# EAGLE design dueSkelMADE (EAGLE 8.2.2)
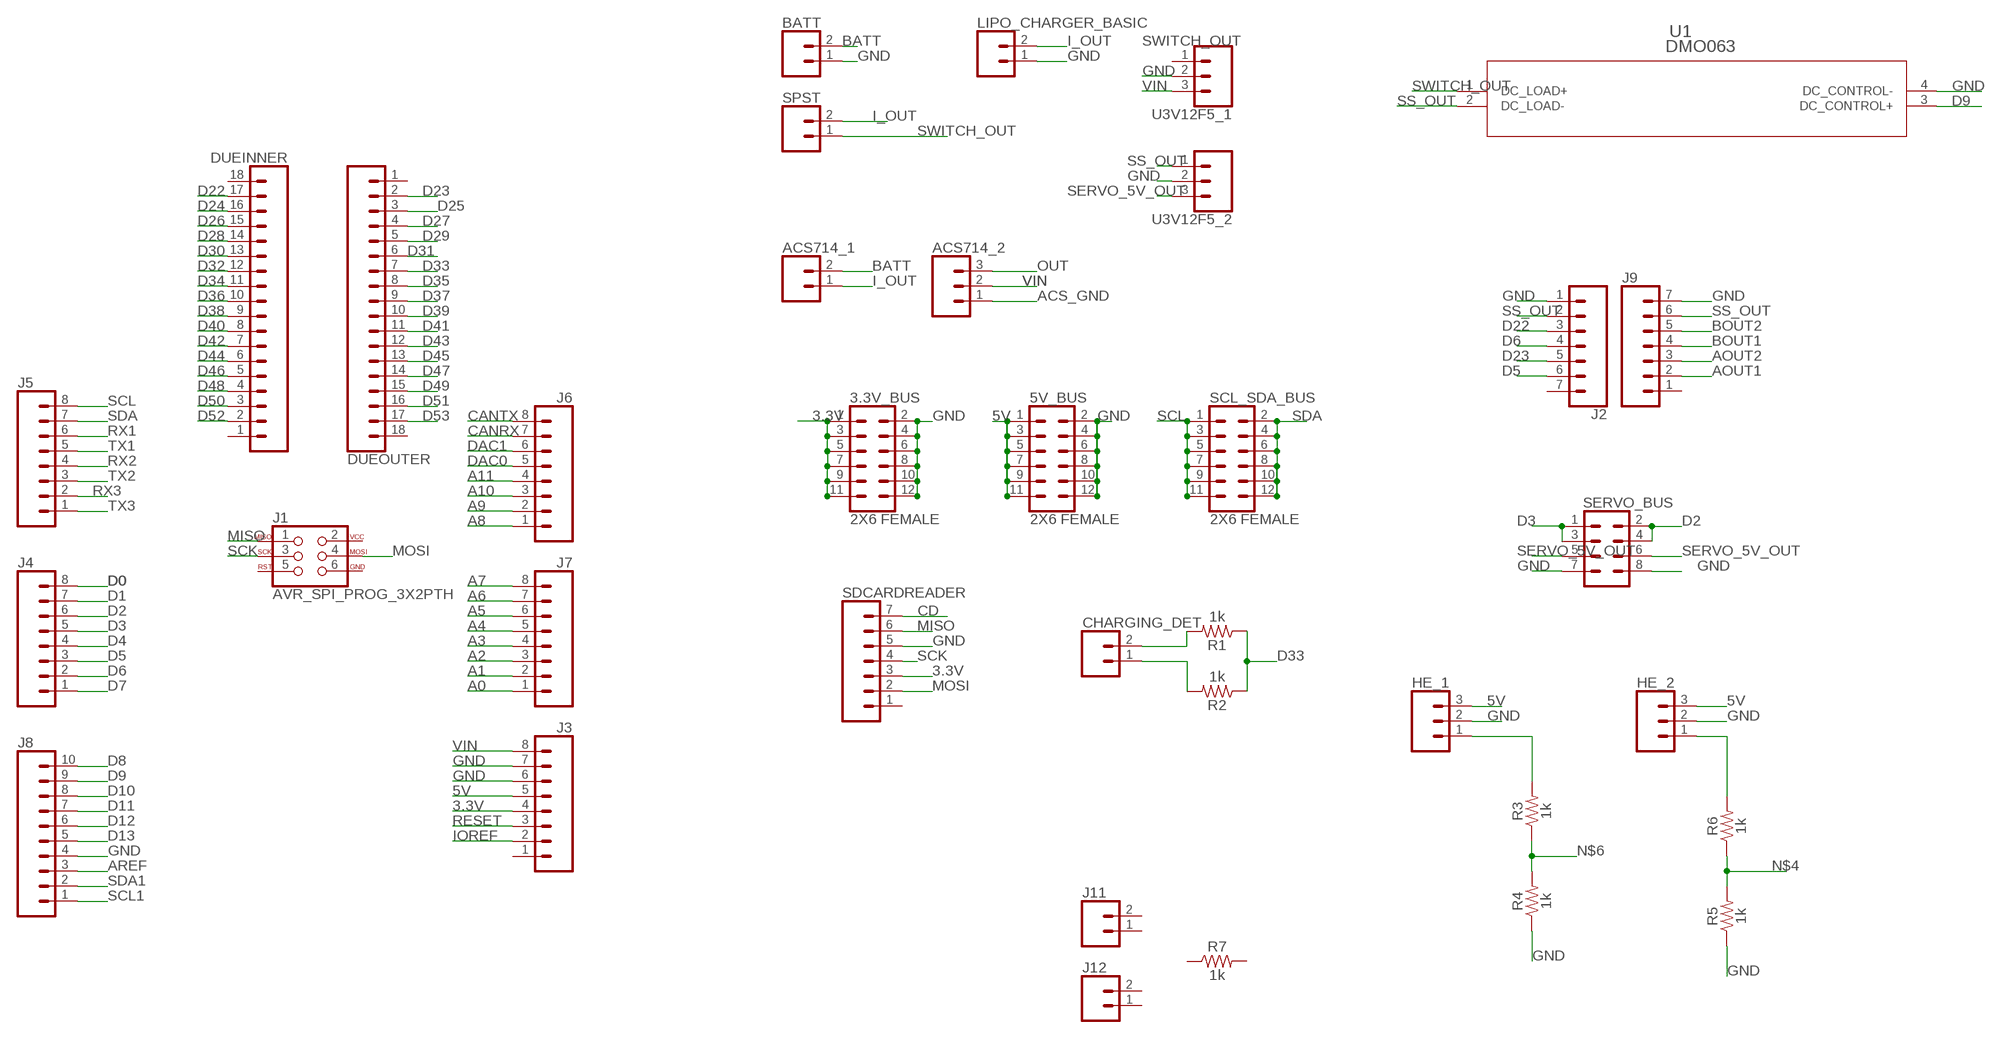
[diagram p0: schematic, sheet 1]

## Parts
3.3V_BUS  2X6 FEMALE  CONN_06X2PTH_FEMALE  [2X6]
5V_BUS  2X6 FEMALE  CONN_06X2PTH_FEMALE  [2X6]
ACS714_1  CONN_02  [1X02]
ACS714_2  CONN_03  [1X03]
BATT  CONN_02  [1X02]
CHARGING_DET  CONN_02  [1X02]
DUEINNER  CONN_18  [1X18]
DUEOUTER  CONN_18  [1X18]
HE_1  CONN_03  [1X03]
HE_2  CONN_03  [1X03]
J1  AVR_SPI_PROG_3X2PTH  [2X3]
J2  CONN_07  [1X07]
J3  CONN_08"  [1X08]
J4  CONN_08"  [1X08]
J5  CONN_08"  [1X08]
J6  CONN_08"  [1X08]
J7  CONN_08"  [1X08]
J8  CONN_10"  [1X10]
J9  CONN_07  [1X07]
J11  CONN_02  [1X02]
J12  CONN_02  [1X02]
LIPO_CHARGER_BASIC  CONN_02  [1X02]
R1  1k  1KOHM-HORIZ-1/4W-1%  [AXIAL-0.3]
R2  1k  1KOHM-HORIZ-1/4W-1%  [AXIAL-0.3]
R3  1k  1KOHM-HORIZ-1/4W-1%  [AXIAL-0.3]
R4  1k  1KOHM-HORIZ-1/4W-1%  [AXIAL-0.3]
R5  1k  1KOHM-HORIZ-1/4W-1%  [AXIAL-0.3]
R6  1k  1KOHM-HORIZ-1/4W-1%  [AXIAL-0.3]
R7  1k  1KOHM-HORIZ-1/4W-1%  [AXIAL-0.3]
SCL_SDA_BUS  2X6 FEMALE  CONN_06X2PTH_FEMALE  [2X6]
SDCARDREADER  CONN_07  [1X07]
SERVO_BUS  CONN_04X2  [2X4]
SPST  CONN_02  [1X02]
U1  DMO063  [SIP-4_DMO]
U3V12F5_1  CONN_03  [1X03]
U3V12F5_2  CONN_03  [1X03]

## Nets
3.3V: 3.3V_BUS.1 3.3V_BUS.3 3.3V_BUS.5 3.3V_BUS.7 3.3V_BUS.9 3.3V_BUS.11 J3.4 SDCARDREADER.3
5V: 5V_BUS.1 5V_BUS.3 5V_BUS.5 5V_BUS.7 5V_BUS.9 5V_BUS.11 HE_1.3 HE_2.3 J3.5
A0: J7.1
A1: J7.2
A2: J7.3
A3: J7.4
A4: J7.5
A5: J7.6
A6: J7.7
A7: J7.8
A8: J6.1
A9: J6.2
A10: J6.3
A11: J6.4
ACS_GND: ACS714_2.1
AOUT1: J9.2
AOUT2: J9.3
AREF: J8.3
BATT: ACS714_1.2 BATT.2
BOUT1: J9.4
BOUT2: J9.5
CANRX: J6.7
CANTX: J6.8
CD: SDCARDREADER.7
D0: J4.8
D1: J4.7
D2: J4.6 SERVO_BUS.2 SERVO_BUS.4
D3: J4.5 SERVO_BUS.1 SERVO_BUS.3
D4: J4.4
D5: J2.6 J4.3
D6: J2.4 J4.2
D7: J4.1
D8: J8.10
D9: J8.9 U1.3(DC_CONTROL+)
D10: J8.8
D11: J8.7
D12: J8.6
D13: J8.5
D22: DUEINNER.17 J2.3
D23: DUEOUTER.2 J2.5
D24: DUEINNER.16
D25: DUEOUTER.3
D26: DUEINNER.15
D27: DUEOUTER.4
D28: DUEINNER.14
D29: DUEOUTER.5
D30: DUEINNER.13
D31: DUEOUTER.6
D32: DUEINNER.12
D33: DUEOUTER.7 R1.P$1 R2.P$1
D34: DUEINNER.11
D35: DUEOUTER.8
D36: DUEINNER.10
D37: DUEOUTER.9
D38: DUEINNER.9
D39: DUEOUTER.10
D40: DUEINNER.8
D41: DUEOUTER.11
D42: DUEINNER.7
D43: DUEOUTER.12
D44: DUEINNER.6
D45: DUEOUTER.13
D46: DUEINNER.5
D47: DUEOUTER.14
D48: DUEINNER.4
D49: DUEOUTER.15
D50: DUEINNER.3
D51: DUEOUTER.16
D52: DUEINNER.2
D53: DUEOUTER.17
DAC0: J6.5
DAC1: J6.6
GND: 3.3V_BUS.2 3.3V_BUS.4 3.3V_BUS.6 3.3V_BUS.8 3.3V_BUS.10 3.3V_BUS.12 5V_BUS.2 5V_BUS.4 5V_BUS.6 5V_BUS.8 5V_BUS.10 5V_BUS.12 BATT.1 HE_1.2 HE_2.2 J2.1 J3.6 J3.7 J8.4 J9.7 LIPO_CHARGER_BASIC.1 R4.P$1 R5.P$1 SDCARDREADER.5 SERVO_BUS.7 SERVO_BUS.8 U1.4(DC_CONTROL-) U3V12F5_1.2 U3V12F5_2.2
I_OUT: ACS714_1.1 LIPO_CHARGER_BASIC.2 SPST.2
IOREF: J3.2
MISO: J1.1 SDCARDREADER.6
MOSI: J1.4 SDCARDREADER.2
N$1: CHARGING_DET.1 R2.P$2
N$2: CHARGING_DET.2 R1.P$2
N$3: HE_2.1 R6.P$2
N$4: R5.P$2 R6.P$1
N$5: HE_1.1 R3.P$2
N$6: R3.P$1 R4.P$2
OUT: ACS714_2.3
RESET: J3.3
RX1: J5.6
RX2: J5.4
RX3: J5.2
SCK: J1.3 SDCARDREADER.4
SCL: J5.8 SCL_SDA_BUS.1 SCL_SDA_BUS.3 SCL_SDA_BUS.5 SCL_SDA_BUS.7 SCL_SDA_BUS.9 SCL_SDA_BUS.11
SCL1: J8.1
SDA: J5.7 SCL_SDA_BUS.2 SCL_SDA_BUS.4 SCL_SDA_BUS.6 SCL_SDA_BUS.8 SCL_SDA_BUS.10 SCL_SDA_BUS.12
SDA1: J8.2
SERVO_5V_OUT: SERVO_BUS.5 SERVO_BUS.6 U3V12F5_2.3
SS_OUT: J2.2 J9.6 U1.2(DC_LOAD-) U3V12F5_2.1
SWITCH_OUT: SPST.1 U1.1(DC_LOAD+)
TX1: J5.5
TX2: J5.3
TX3: J5.1
VIN: ACS714_2.2 J3.8 U3V12F5_1.3
Unconnected: DUEINNER.1 DUEINNER.18 DUEOUTER.1 DUEOUTER.18 J1.2 J1.5 J1.6 J2.7 J3.1 J9.1 J11.1 J11.2 J12.1 J12.2 R7.P$1 R7.P$2 SDCARDREADER.1 U3V12F5_1.1

## Library data of the parts
3.3V_BUS 5V_BUS SCL_SDA_BUS = SparkFun-Connectors:CONN_06X2: Multi connection point. Often used as Generic Header-pin footprint for 0.1 inch spaced/style header connections On any of the 0.1 inch spaced packages, you can populate with these: Break Away Headers - Straight <https://www.sparkfun.com/products/116> (PRT-00116) Break Away Male Headers - Right Angle <https://www.sparkfun.com/products/553> (PRT-00553) Female Headers <https://www.sparkfun.com/products/115> (PRT-00115) Break Away Headers - Machine Pin <https://www.sparkfun.com/products/117> (PRT-00117) Break Away Female Headers - Swiss Machine Pin <https://www.sparkfun.com/products/743> (PRT-00743); PROD_ID: CONN-12423
ACS714_1 BATT CHARGING_DET J11 J12 LIPO_CHARGER_BASIC SPST = SparkFun-Connectors:CONN_02: Multi connection point. Often used as Generic Header-pin footprint for 0.1 inch spaced/style header connections On any of the 0.1 inch spaced packages, you can populate with these: Break Away Headers - Straight <https://www.sparkfun.com/products/116> (PRT-00116) Break Away Male Headers - Right Angle <https://www.sparkfun.com/products/553> (PRT-00553) Female Headers <https://www.sparkfun.com/products/115> (PRT-00115) Break Away Headers - Machine Pin <https://www.sparkfun.com/products/117> (PRT-00117) Break Away Female Headers - Swiss Machine Pin <https://www.sparkfun.com/products/743> (PRT-00743) For SCREWTERMINALS and SPRING TERMINALS visit here: Screw Terimnals on SparkFun.com <https://www.sparkfun.com/search/results?term=Screw+Terminals> (5mm/3.5mm/2.54mm spacing) This device is also useful as a general connection point to wire up your design to another part of your project. Our various solder wires solder well into these plated through hole pads. Hook-Up Wire - Assortment (Stranded, 22 AWG) <https://www.sparkfun.com/products/11375> (PRT-11375) Hook-Up Wire - Assortment (Solid Core, 22 AWG) <https://www.sparkfun.com/products/11367> (PRT-11367) View the entire wire category on our website here <https://www.sparkfun.com/categories/141> Special notes: Molex polarized connector foot print use with: PRT-08233 with associated crimp pins and housings. 2.54_SCREWTERM for use with PRT-10571. 3.5mm Screw Terminal footprints for PRT-08084 5mm Screw Terminal footprints for use with PRT-08432
ACS714_2 HE_1 HE_2 U3V12F5_1 U3V12F5_2 = SparkFun-Connectors:CONN_03: Multi connection point. Often used as Generic Header-pin footprint for 0.1 inch spaced/style header connections On any of the 0.1 inch spaced packages, you can populate with these: Break Away Headers - Straight <https://www.sparkfun.com/products/116> (PRT-00116) Break Away Male Headers - Right Angle <https://www.sparkfun.com/products/553> (PRT-00553) Female Headers <https://www.sparkfun.com/products/115> (PRT-00115) Break Away Headers - Machine Pin <https://www.sparkfun.com/products/117> (PRT-00117) Break Away Female Headers - Swiss Machine Pin <https://www.sparkfun.com/products/743> (PRT-00743) Stackable Header - 3 Pin (Female, 0.1") <https://www.sparkfun.com/products/13875> (PRT-13875) For SCREWTERMINALS and SPRING TERMINALS visit here: Screw Terimnals on SparkFun.com <https://www.sparkfun.com/search/results?term=Screw+Terminals> (5mm/3.5mm/2.54mm spacing) This device is also useful as a general connection point to wire up your design to another part of your project. Our various solder wires solder well into these plated through hole pads. Hook-Up Wire - Assortment (Stranded, 22 AWG) <https://www.sparkfun.com/products/11375> (PRT-11375) Hook-Up Wire - Assortment (Solid Core, 22 AWG) <https://www.sparkfun.com/products/11367> (PRT-11367) View the entire wire category on our website here <https://www.sparkfun.com/categories/141> Special notes: Molex polarized connector foot print use with SKU : PRT-08232 with associated crimp pins and housings.
DUEINNER DUEOUTER = SparkFun-Connectors:CONN_18: Multi connection point. Often used as Generic Header-pin footprint for 0.1 inch spaced/style header connections On any of the 0.1 inch spaced packages, you can populate with these: Break Away Headers - Straight <https://www.sparkfun.com/products/116> (PRT-00116) Break Away Male Headers - Right Angle <https://www.sparkfun.com/products/553> (PRT-00553) Female Headers <https://www.sparkfun.com/products/115> (PRT-00115) Break Away Headers - Machine Pin <https://www.sparkfun.com/products/117> (PRT-00117) Break Away Female Headers - Swiss Machine Pin <https://www.sparkfun.com/products/743> (PRT-00743) For SCREWTERMINALS and SPRING TERMINALS visit here: Screw Terimnals on SparkFun.com <https://www.sparkfun.com/search/results?term=Screw+Terminals> (5mm/3.5mm/2.54mm spacing) This device is also useful as a general connection point to wire up your design to another part of your project. Our various solder wires solder well into these plated through hole pads. Hook-Up Wire - Assortment (Stranded, 22 AWG) <https://www.sparkfun.com/products/11375> (PRT-11375) Hook-Up Wire - Assortment (Solid Core, 22 AWG) <https://www.sparkfun.com/products/11367> (PRT-11367) View the entire wire category on our website here <https://www.sparkfun.com/categories/141> Special notes: Molex polarized connector foot print use with SKU : PRT-08231 with associated crimp pins and housings. 1MM SMD Version SKU: PRT-10208 NOTES ON THE VARIANTS LOCK and LOCK_LONGPADS... This footprint was designed to help hold the alignment of a through-hole component (i.e. 6-pin header) while soldering it into place. You may notice that each hole has been shifted either up or down by 0.005 of an inch from it's more standard position (which is a perfectly straight line). This slight alteration caused the pins (the squares in the middle) to touch the edges of the holes. Because they are alternating, it causes a "brace" to hold the component in place. 0.005 has proven to be the perfect amount of "off-center" position when using our standard breakaway headers. Although looks a little odd when you look at the bare footprint, once you have a header in there, the alteration is very hard to notice. Also,if you push a header all the way into place, it is covered up entirely on the bottom side.
J1 = SparkFun-Connectors:AVR_SPI_PROG_3X2: AVR ISP 6 Pin This is the reduced ISP connector for AVR programming. Common on Arduino. This footprint will take up less PCB space and can be used with a 10-pin to 6-pin adapter such as SKU: BOB-08508 **Special note about "TEST_POINT" package. The stop mask is on the top side, so if you want your programming test points to be on the bottom of your board, make sure to place this package on the bottom side of the board. This also ensure that the orientation to program from the bottom side will be correct. SparkFun Products: SparkFun ISP Pogo Adapter <https://www.sparkfun.com/products/11591> - NS Tiny AVR Programmer <https://www.sparkfun.com/products/11801> -PTH
J2 J9 SDCARDREADER = SparkFun-Connectors:CONN_07: Multi connection point. Often used as Generic Header-pin footprint for 0.1 inch spaced/style header connections On any of the 0.1 inch spaced packages, you can populate with these: Break Away Headers - Straight <https://www.sparkfun.com/products/116> (PRT-00116) Break Away Male Headers - Right Angle <https://www.sparkfun.com/products/553> (PRT-00553) Female Headers <https://www.sparkfun.com/products/115> (PRT-00115) Break Away Headers - Machine Pin <https://www.sparkfun.com/products/117> (PRT-00117) Break Away Female Headers - Swiss Machine Pin <https://www.sparkfun.com/products/743> (PRT-00743) For SCREWTERMINALS and SPRING TERMINALS visit here: Screw Terimnals on SparkFun.com <https://www.sparkfun.com/search/results?term=Screw+Terminals> (5mm/3.5mm/2.54mm spacing) This device is also useful as a general connection point to wire up your design to another part of your project. Our various solder wires solder well into these plated through hole pads. Hook-Up Wire - Assortment (Stranded, 22 AWG) <https://www.sparkfun.com/products/11375> (PRT-11375) Hook-Up Wire - Assortment (Solid Core, 22 AWG) <https://www.sparkfun.com/products/11367> (PRT-11367) View the entire wire category on our website here <https://www.sparkfun.com/categories/141> Special notes: Molex polarized connector foot print use with SKU : PRT-08231 with associated crimp pins and housings. 1MM SMD Version SKU: PRT-10208 NOTES ON THE VARIANTS LOCK and LOCK_LONGPADS... This footprint was designed to help hold the alignment of a through-hole component (i.e. 6-pin header) while soldering it into place. You may notice that each hole has been shifted either up or down by 0.005 of an inch from it's more standard position (which is a perfectly straight line). This slight alteration caused the pins (the squares in the middle) to touch the edges of the holes. Because they are alternating, it causes a "brace" to hold the component in place. 0.005 has proven to be the perfect amount of "off-center" position when using our standard breakaway headers. Although looks a little odd when you look at the bare footprint, once you have a header in there, the alteration is very hard to notice. Also,if you push a header all the way into place, it is covered up entirely on the bottom side.
J3-J7 = SparkFun-Connectors:CONN_08: Multi connection point. Often used as Generic Header-pin footprint for 0.1 inch spaced/style header connections On any of the 0.1 inch spaced packages, you can populate with these: Break Away Headers - Straight <https://www.sparkfun.com/products/116> (PRT-00116) Break Away Male Headers - Right Angle <https://www.sparkfun.com/products/553> (PRT-00553) Female Headers <https://www.sparkfun.com/products/115> (PRT-00115) Break Away Headers - Machine Pin <https://www.sparkfun.com/products/117> (PRT-00117) Break Away Female Headers - Swiss Machine Pin <https://www.sparkfun.com/products/743> (PRT-00743) Arduino Stackable Header - 8 Pin <https://www.sparkfun.com/products/9279> (PRT-09279) For SCREWTERMINALS and SPRING TERMINALS visit here: Screw Terimnals on SparkFun.com <https://www.sparkfun.com/search/results?term=Screw+Terminals> (5mm/3.5mm/2.54mm spacing) This device is also useful as a general connection point to wire up your design to another part of your project. Our various solder wires solder well into these plated through hole pads. Hook-Up Wire - Assortment (Stranded, 22 AWG) <https://www.sparkfun.com/products/11375> (PRT-11375) Hook-Up Wire - Assortment (Solid Core, 22 AWG) <https://www.sparkfun.com/products/11367> (PRT-11367) View the entire wire category on our website here <https://www.sparkfun.com/categories/141> Special notes: Molex polarized connector foot print use with SKU : PRT-08231 with associated crimp pins and housings. 1MM SMD Version SKU: PRT-10208 NOTES ON THE VARIANTS LOCK and LOCK_LONGPADS... This footprint was designed to help hold the alignment of a through-hole component (i.e. 6-pin header) while soldering it into place. You may notice that each hole has been shifted either up or down by 0.005 of an inch from it's more standard position (which is a perfectly straight line). This slight alteration caused the pins (the squares in the middle) to touch the edges of the holes. Because they are alternating, it causes a "brace" to hold the component in place. 0.005 has proven to be the perfect amount of "off-center" position when using our standard breakaway headers. Although looks a little odd when you look at the bare footprint, once you have a header in there, the alteration is very hard to notice. Also,if you push a header all the way into place, it is covered up entirely on the bottom side.; PROD_ID: CONN-08438
J8 = SparkFun-Connectors:CONN_10: Multi connection point. Often used as Generic Header-pin footprint for 0.1 inch spaced/style header connections On any of the 0.1 inch spaced packages, you can populate with these: Break Away Headers - Straight <https://www.sparkfun.com/products/116> (PRT-00116) Break Away Male Headers - Right Angle <https://www.sparkfun.com/products/553> (PRT-00553) Female Headers <https://www.sparkfun.com/products/115> (PRT-00115) Break Away Headers - Machine Pin <https://www.sparkfun.com/products/117> (PRT-00117) Break Away Female Headers - Swiss Machine Pin <https://www.sparkfun.com/products/743> (PRT-00743) Arduino Stackable Header - 10 Pin <https://www.sparkfun.com/products/11376> (PRT-11376) For SCREWTERMINALS and SPRING TERMINALS visit here: Screw Terimnals on SparkFun.com <https://www.sparkfun.com/search/results?term=Screw+Terminals> (5mm/3.5mm/2.54mm spacing) This device is also useful as a general connection point to wire up your design to another part of your project. Our various solder wires solder well into these plated through hole pads. Hook-Up Wire - Assortment (Stranded, 22 AWG) <https://www.sparkfun.com/products/11375> (PRT-11375) Hook-Up Wire - Assortment (Solid Core, 22 AWG) <https://www.sparkfun.com/products/11367> (PRT-11367) View the entire wire category on our website here <https://www.sparkfun.com/categories/141> Special notes: Molex polarized connector foot print use with SKU : PRT-08231 with associated crimp pins and housings. 1MM SMD Version SKU: PRT-10208 NOTES ON THE VARIANTS LOCK and LOCK_LONGPADS... This footprint was designed to help hold the alignment of a through-hole component (i.e. 6-pin header) while soldering it into place. You may notice that each hole has been shifted either up or down by 0.005 of an inch from it's more standard position (which is a perfectly straight line). This slight alteration caused the pins (the squares in the middle) to touch the edges of the holes. Because they are alternating, it causes a "brace" to hold the component in place. 0.005 has proven to be the perfect amount of "off-center" position when using our standard breakaway headers. Although looks a little odd when you look at the bare footprint, once you have a header in there, the alteration is very hard to notice. Also,if you push a header all the way into place, it is covered up entirely on the bottom side.; PROD_ID: CONN-11563
R1-R7 = SparkFun-Resistors:1KOHM: 1kΩ resistor A resistor is a passive two-terminal electrical component that implements electrical resistance as a circuit element. Resistors act to reduce current flow, and, at the same time, act to lower voltage levels within circuits. - Wikipedia; PROD_ID: RES-12182
SERVO_BUS = SparkFun-Connectors:CONN_04X2: Multi connection point. Often used as Generic Header-pin footprint for 0.1 inch spaced/style header connections On any of the 0.1 inch spaced packages, you can populate with these: Break Away Headers - Straight <https://www.sparkfun.com/products/116> (PRT-00116) Break Away Male Headers - Right Angle <https://www.sparkfun.com/products/553> (PRT-00553) Female Headers <https://www.sparkfun.com/products/115> (PRT-00115) Break Away Headers - Machine Pin <https://www.sparkfun.com/products/117> (PRT-00117) Break Away Female Headers - Swiss Machine Pin <https://www.sparkfun.com/products/743> (PRT-00743)
U1 = digikeyDMO063:DMO063; MANUFACTURER_PART_NUMBER: DMO063; VENDOR: CRYDOM

## Board
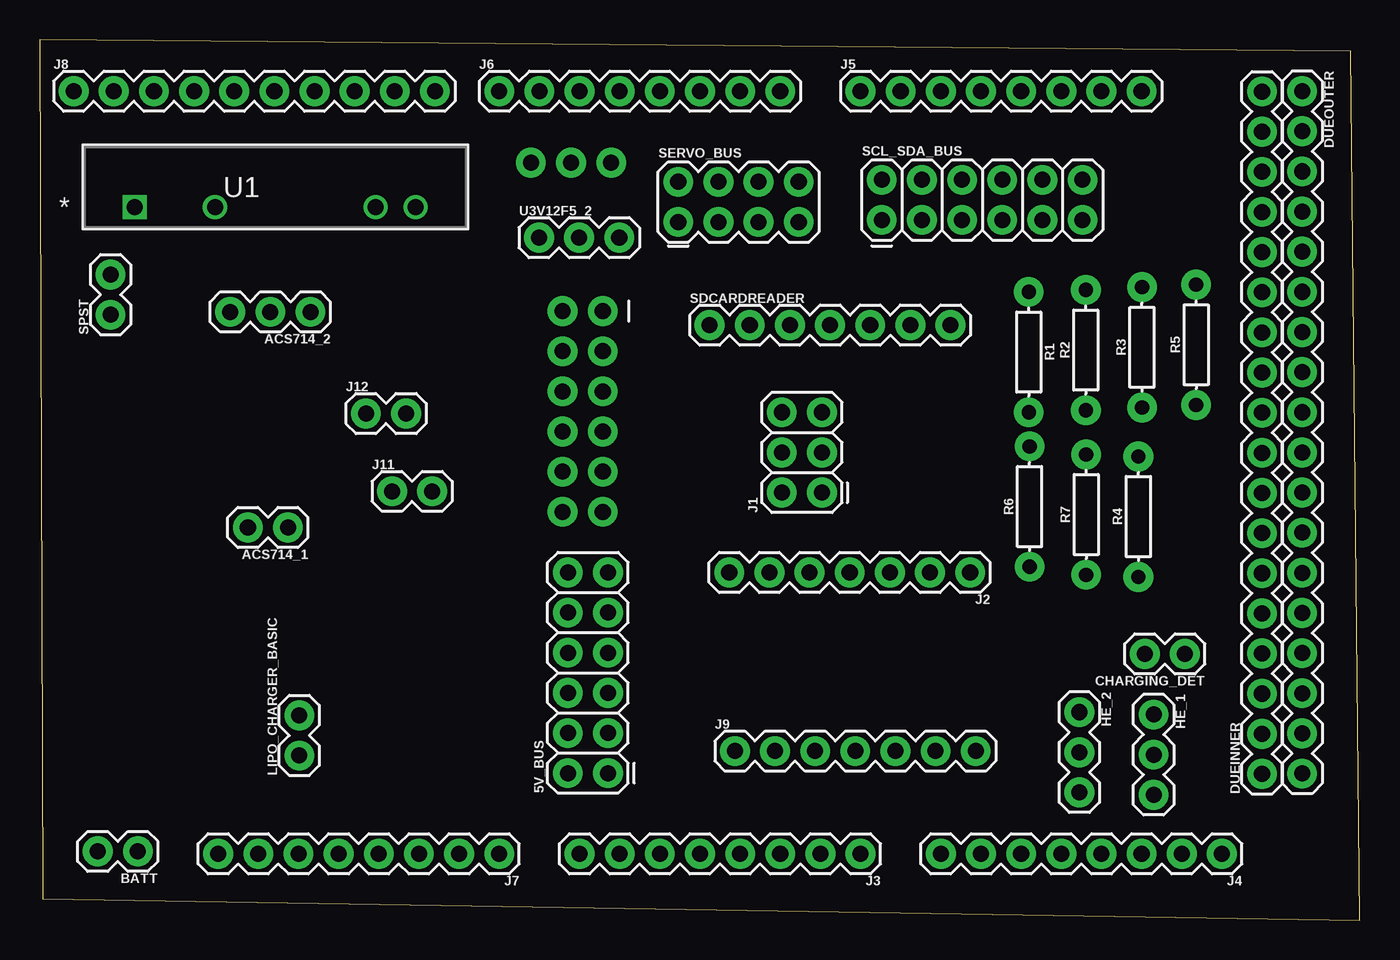
[diagram p1: board, top side]
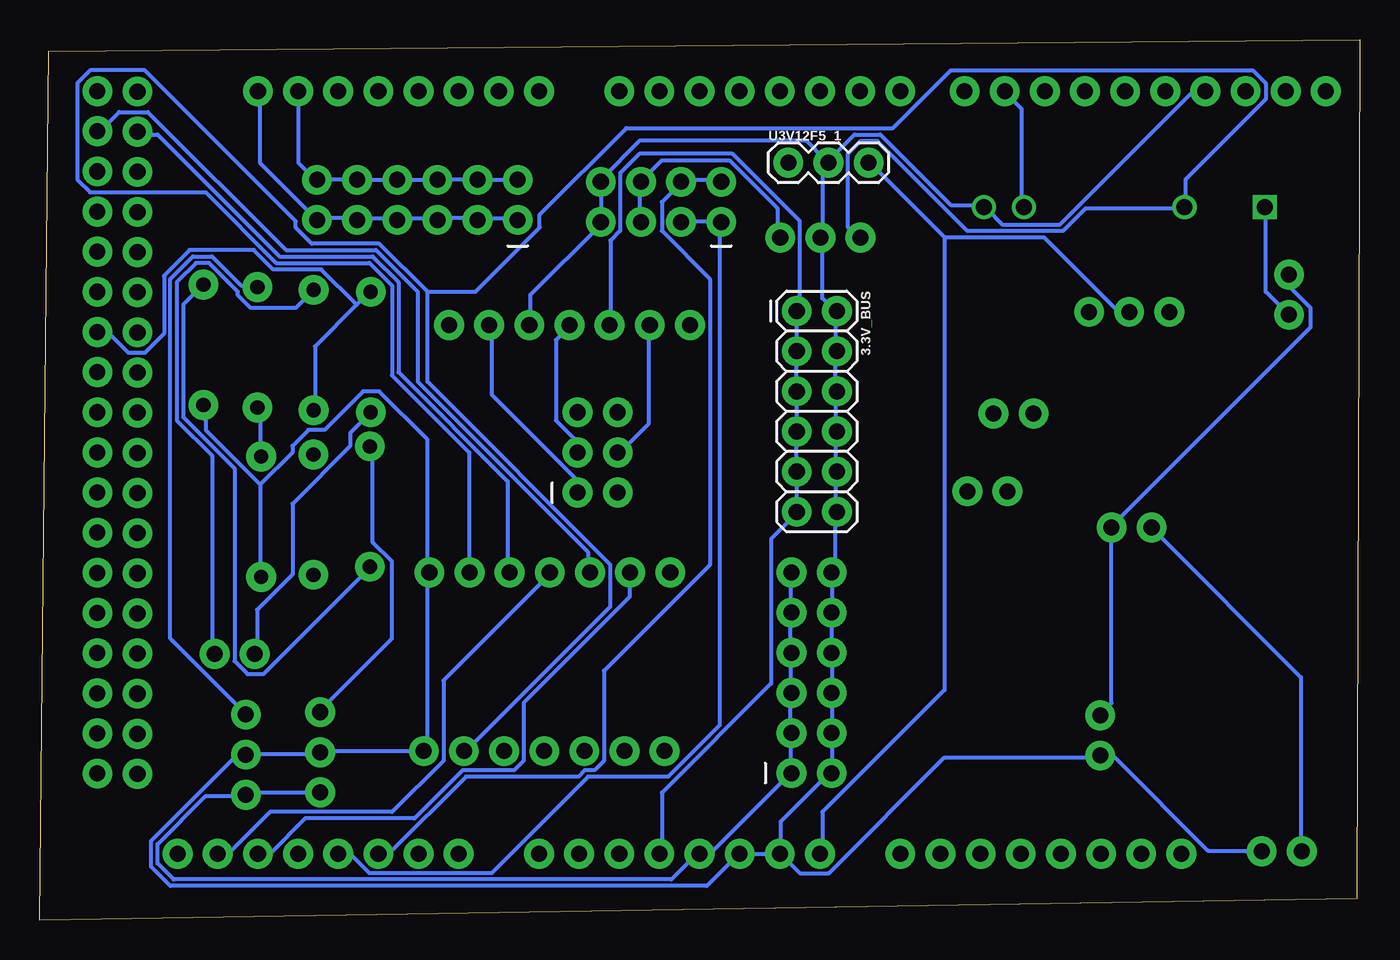
[diagram p2: board, bottom side, seen from below]

Size 83.54 x 55.72 mm. Coordinates in mm from the lower left corner, seen from the top.
Outline: 0.2,1.35 83.54,0 82.96,54.98 0,55.72 0.2,1.35
Copper layers (1*16): Top 0.035mm / dielectric 1.5mm / Bottom 0.035mm
Design rules "default *": minimum track width 10mil, minimum drill 0.35mm, track to track 6mil, track to pad 6mil, pad to pad 6mil, via to via 6mil, smd to smd 6mil, copper to edge 40mil, drill to drill 6mil, minimum pad ring 10mil, minimum via ring 8mil, stop-mask expansion 4mil, vias tented up to drill 0mil, thermal gap 10mil

### Footprints (pad centres in the part's own frame; a part is rotated, then mirrored left to right if it is on the bottom)
2X6 = drill 1.016 pad 1.88: 1 0,0; 2 0,2.54; 3 2.54,0; 4 2.54,2.54; 5 5.08,0; 6 5.08,2.54; 7 7.62,0; 8 7.62,2.54; 9 10.16,0; 10 10.16,2.54; 11 12.7,0; 12 12.7,2.54
1X02 = drill 1.016 pad 1.88: 1 0,0; 2 2.54,0
1X03 = drill 1.016 pad 1.88: 1 0,0; 2 2.54,0; 3 5.08,0
1X18 = drill 1.016 pad 1.88: 1 0,0; 2 2.54,0; 3 5.08,0; 4 7.62,0; 5 10.16,0; 6 12.7,0; 7 15.24,0; 8 17.78,0; 9 20.32,0; 10 22.86,0; 11 25.4,0; 12 27.94,0; 13 30.48,0; 14 33.02,0; 15 35.56,0; 16 38.1,0; 17 40.64,0; 18 43.18,0
2X3 = drill 1.016 pad 1.88: 1 0,0; 2 0,2.54; 3 2.54,0; 4 2.54,2.54; 5 5.08,0; 6 5.08,2.54
1X07 = drill 1.016 pad 1.88: 1 0,0; 2 2.54,0; 3 5.08,0; 4 7.62,0; 5 10.16,0; 6 12.7,0; 7 15.24,0
1X08 = drill 1.016 pad 1.88: 1 0,0; 2 2.54,0; 3 5.08,0; 4 7.62,0; 5 10.16,0; 6 12.7,0; 7 15.24,0; 8 17.78,0
1X10 = drill 1.016 pad 1.88: 1 0,0; 2 2.54,0; 3 5.08,0; 4 7.62,0; 5 10.16,0; 6 12.7,0; 7 15.24,0; 8 17.78,0; 9 20.32,0; 10 22.86,0
AXIAL-0.3 = drill 0.9 pad 1.88: P$1 -3.81,0; P$2 3.81,0
2X4 = drill 1.016 pad 1.88: 1 -3.81,-1.27; 2 -3.81,1.27; 3 -1.27,-1.27; 4 -1.27,1.27; 5 1.27,-1.27; 6 1.27,1.27; 7 3.81,-1.27; 8 3.81,1.27
SIP-4_DMO = drill 1.016 pad 1.524 square: 1 -17.78,-2.54 | drill 1.016 pad 1.524: 2 -12.7,-2.54; 3 -2.54,-2.54; 4 0,-2.54

### Placement (x,y rotation side)
3.3V_BUS  35.64,38.53 270 bottom
5V_BUS  35.97,9.3 90 top
ACS714_1  15.72,24.84 180 top
ACS714_2  17.14,38.48 180 top
BATT  6.22,4.34 180 top
CHARGING_DET  72.47,16.84 180 top
DUEINNER  77.34,9.25 90 top
DUEOUTER  79.88,52.45 270 top
HE_1  70.48,13 270 top
HE_2  65.79,13.16 270 top
J1  49.5,27.05 90 top
J2  58.88,22 180 top
J3  51.94,4.19 180 top
J4  74.8,4.19 180 top
J5  51.94,52.45 0 top
J6  29.08,52.45 0 top
J7  29.08,4.19 180 top
J8  2.16,52.45 0 top
J9  43.99,10.69 0 top
J11  22.3,27.13 0 top
J12  20.65,32.05 0 top
LIPO_CHARGER_BASIC  16.43,10.41 90 top
R1  62.59,35.94 270 top
R2  66.19,36.07 90 top
R3  69.75,36.25 90 top
R4  69.52,25.53 90 top
R5  73.18,36.4 90 top
R6  62.64,26.16 90 top
R7  66.22,25.65 90 top
SCL_SDA_BUS  53.29,44.3 0 top
SDCARDREADER  42.39,37.64 0 top
SERVO_BUS  44.22,45.44 0 top
SPST  4.5,38.3 90 top
U1  23.8,47.65 0 top
U3V12F5_1  36.17,47.93 0 bottom
U3V12F5_2  31.6,43.18 0 top

### Tracks (layer width: path | path; a pad name or v marks a point on that pad's centre or on a via)
3.3V
  Bottom 0.254: SDCARDREADER.3 47.42,37.72 47.42,43 46.81,43.61 46.81,47.27 45.59,48.49 39.7,48.49 35.43,44.22 35.43,38.73 3.3V_BUS.1 3.3V_BUS.3 3.3V_BUS.5 3.3V_BUS.7 3.3V_BUS.9 3.3V_BUS.11 35.64,25.73 37.26,24.11 37.26,14.96 44.17,8.05 44.17,4.19 J3.4
5V
  Bottom 0.254: HE_2.3 65.91,8.05 70.38,8.05 HE_1.3 70.59,7.85 73.02,7.85 76.07,4.8 76.07,3.58 75.06,2.57 43.56,2.57 41.93,4.19 J3.5 41.12,4.19 36.04,9.27 5V_BUS.1 36.04,9.47 36.04,11.71 5V_BUS.3 36.04,11.91 36.04,14.35 5V_BUS.5 36.04,14.55 36.04,16.79 5V_BUS.7 36.04,16.99 36.04,19.43 5V_BUS.9 36.04,19.63 36.04,21.87 5V_BUS.11
BATT
  Bottom 0.254: BATT.2 3.73,4.39 3.73,15.37 13.08,24.71 ACS714_1.2
D2
  Bottom 0.254: SERVO_BUS.2 40.51,46.86 42.95,46.86 SERVO_BUS.4 42.95,46.66 44.17,45.44 44.17,43.61 41.12,40.56 41.12,22.48 47.83,15.77 47.83,10.08 48.44,9.47 49.05,9.47 49.45,9.07 56.57,9.07 61.44,4.19 J4.6
D3
  Bottom 0.254: SERVO_BUS.3 42.95,44.22 40.51,44.22 SERVO_BUS.1 40.51,44.02 40.51,12.32 43.76,9.07 48.84,9.07 54.94,2.97 62.66,2.97 63.88,4.19 J4.5
D5
  Bottom 0.254: J4.3 68.96,4.19 66.73,6.43 59.82,6.43 56.77,9.47 53.52,9.47 52.91,10.08 52.91,13.74 46.2,20.45 46.2,21.87 J2.6
D6
  Bottom 0.254: J4.2 71.6,4.19 68.96,6.83 61.24,6.83 57.99,10.08 57.99,15.16 51.28,21.87 J2.4
D9
  Bottom 0.254: U1.3 21.41,45.24 21.41,51.33 22.43,52.35 J8.9
D22
  Bottom 0.254: J2.3 53.92,22.07 53.92,27.76 60.83,34.67 60.83,40.36 62.46,41.99 68.35,41.99 76.07,49.71 77.29,49.71 DUEINNER.17
D23
  Bottom 0.254: J2.5 48.84,22.07 48.84,23.29 59.61,34.06 59.61,39.75 62.25,42.39 67.94,42.39 76.68,51.13 78.51,51.13 79.73,49.91 DUEOUTER.2
D33
  Bottom 0.254: 63.47,38.94 62.66,39.75 R1.P$1 | 63.47,38.94 66.12,36.3 66.12,32.44 R2.P$1 | 63.47,38.94 65.71,41.17 68.76,41.17 69.98,42.39 74.04,42.39 75.67,40.77 75.67,37.11 76.89,35.89 77.9,35.89 79.12,37.11 79.73,37.11 DUEOUTER.7
GND
  Bottom 0.254: SDCARDREADER.5 52.5,37.72 52.5,39.55 48.03,44.02 SERVO_BUS.7 SERVO_BUS.8 48.03,46.86 45.59,49.3 35.03,49.3 33.81,48.08 U3V12F5_1.2 | U3V12F5_1.2 33.6,48.08 31.98,49.71 30.35,49.71 25.88,45.24 23.85,45.24 U1.4 23.65,45.03 22.63,44.02 18.97,44.02 10.64,52.35 9.83,52.35 J8.4 | U3V12F5_1.2 33.81,47.88 34.01,47.68 34.01,43.2 U3V12F5_2.2 34.01,43 34.01,39.34 33.2,38.53 | 69.57,27.56 69.57,21.87 R4.P$1 | 69.57,27.56 73.02,31.01 73.02,32.44 R5.P$1 | 69.57,27.56 67.54,29.59 67.54,30 66.52,31.01 65.51,31.01 63.07,33.45 62.05,33.45 59,30.4 59,22.07 J2.1 59,21.87 59,10.9 59.21,10.69 J9.7 65.71,10.69 HE_2.2 65.91,10.49 70.38,10.49 HE_1.2 70.59,10.29 71.2,10.29 76.48,5 76.48,3.38 75.26,2.16 41.33,2.16 39.29,4.19 J3.6 J3.7 36.65,4.19 | BATT.1 6.38,4.39 9.63,4.39 15.52,10.29 16.33,10.29 LIPO_CHARGER_BASIC.1 16.54,10.29 26.29,10.29 33.6,2.97 35.43,2.97 36.65,4.19 | 33.2,38.53 33.2,36.09 3.3V_BUS.4 33.2,35.89 33.2,33.45 | 33.2,28.37 33.2,25.93 3.3V_BUS.12 33.2,25.73 33.2,22.28 33.4,22.07 5V_BUS.12 33.4,21.87 33.4,19.63 5V_BUS.10 33.4,19.43 33.4,16.99 5V_BUS.8 33.4,16.79 33.4,14.55 5V_BUS.6 33.4,14.35 33.4,11.91 5V_BUS.4 33.4,11.71 33.4,9.47 5V_BUS.2 33.6,9.27 36.65,6.22 36.65,4.19 | 33.2,33.45 33.2,31.01 3.3V_BUS.8 33.2,30.81 33.2,28.37 | 33.2,28.37 3.3V_BUS.10 | 33.2,33.45 3.3V_BUS.6 | 33.2,38.53 3.3V_BUS.2
I_OUT
  Bottom 0.254: LIPO_CHARGER_BASIC.2 16.33,13.13 15.72,13.74 ACS714_1.1 15.72,24.92 3.12,37.52 3.12,38.73 4.34,39.95 4.34,40.77 SPST.2
MISO
  Bottom 0.254: J1.1 49.66,27.15 49.66,27.96 54.94,33.25 54.94,37.52 SDCARDREADER.6
MOSI
  Bottom 0.254: SDCARDREADER.2 44.98,37.52 44.98,31.42 46.81,29.59 J1.4
N$1
  Bottom 0.254: R2.P$2 67.33,38.73 70.18,38.73 70.99,39.55 70.99,39.75 72.82,41.58 73.63,41.58 74.85,40.36 74.85,31.62 72.62,29.39 72.62,16.99 CHARGING_DET.1
N$2
  Bottom 0.254: CHARGING_DET.2 69.77,16.99 69.77,19.63 67.54,21.87 67.54,26.34 63.88,30 63.88,30.81 62.66,32.03 R1.P$2
N$3
  Bottom 0.254: R6.P$2 62.46,29.79 62.46,23.9 61.24,22.68 61.24,17.8 65.71,13.34 HE_2.1
N$4
  Bottom 0.254: R5.P$2 74.45,38.94 74.45,31.83 71.2,28.57 71.2,16.38 70.38,15.57 69.37,15.57 62.66,22.28 R6.P$1
N$5
  Bottom 0.254: R3.P$2 69.77,40.16 70.79,40.16 72.62,41.99 73.84,41.99 75.26,40.56 75.26,17.8 70.59,13.13 HE_1.1
N$6
  Bottom 0.254: R4.P$2 69.57,29.39 69.57,32.44 R3.P$1
SCK
  Bottom 0.254: J1.3 49.66,29.59 49.66,30.4 50.88,31.62 50.88,36.7 50.06,37.52 SDCARDREADER.4
SCL
  Bottom 0.254: SCL_SDA_BUS.1 53.31,44.42 55.75,44.42 SCL_SDA_BUS.3 55.96,44.42 58.19,44.42 SCL_SDA_BUS.5 58.39,44.42 60.83,44.42 SCL_SDA_BUS.7 61.04,44.42 63.27,44.42 SCL_SDA_BUS.9 63.47,44.42 65.91,44.42 SCL_SDA_BUS.11 69.57,47.88 69.57,52.35 J5.8
SDA
  Bottom 0.254: SCL_SDA_BUS.2 53.31,46.86 55.75,46.86 SCL_SDA_BUS.4 55.96,46.86 58.19,46.86 SCL_SDA_BUS.6 58.39,46.86 60.83,46.86 SCL_SDA_BUS.8 61.04,46.86 63.27,46.86 SCL_SDA_BUS.10 63.47,46.86 65.91,46.86 SCL_SDA_BUS.12 66.12,46.86 67.13,47.88 67.13,52.35 J5.7
SERVO_5V_OUT
  Bottom 0.254: U3V12F5_2.3 36.85,43.2 36.85,45.03 39.9,48.08 44.17,48.08 45.39,46.86 SERVO_BUS.6 45.59,46.66 45.59,44.22 SERVO_BUS.5
SS_OUT
  Bottom 0.254: U3V12F5_2.1 31.78,43.2 32.38,43.81 32.38,48.49 31.57,49.3 30.56,49.3 24.87,43.61 18.77,43.61 17.35,45.03 11.25,45.03 U1.2 11.05,45.24 11.05,46.86 5.97,51.94 5.97,52.96 6.78,53.77 25.88,53.77 29.54,50.11 46.41,50.11 51.89,44.63 51.89,43.81 55.96,39.75 59,39.75 | 59,39.75 62.05,42.8 66.32,42.8 67.33,43.81 67.33,44.22 76.89,53.77 80.34,53.77 81.15,52.96 81.15,46.86 80.34,46.05 73.02,46.05 68.55,41.58 62.66,41.58 61.24,40.16 61.24,34.47 56.36,29.59 56.36,22.07 J2.2 | 59,39.75 59,34.06 47.42,22.48 47.42,19.84 56.57,10.69 J9.6
SWITCH_OUT
  Bottom 0.254: U1.1 5.97,45.03 5.97,39.75 4.55,38.33 SPST.1
VIN
  Bottom 0.254: 26.29,43.2 19.99,43.2 15.32,38.53 14.71,38.53 ACS714_2.2 | 26.29,43.2 30.96,47.88 U3V12F5_1.3 | 26.29,43.2 26.29,14.55 34.01,6.83 34.01,4.19 J3.8